# Altium schematic sheet Sheet2.SchDoc
size A3
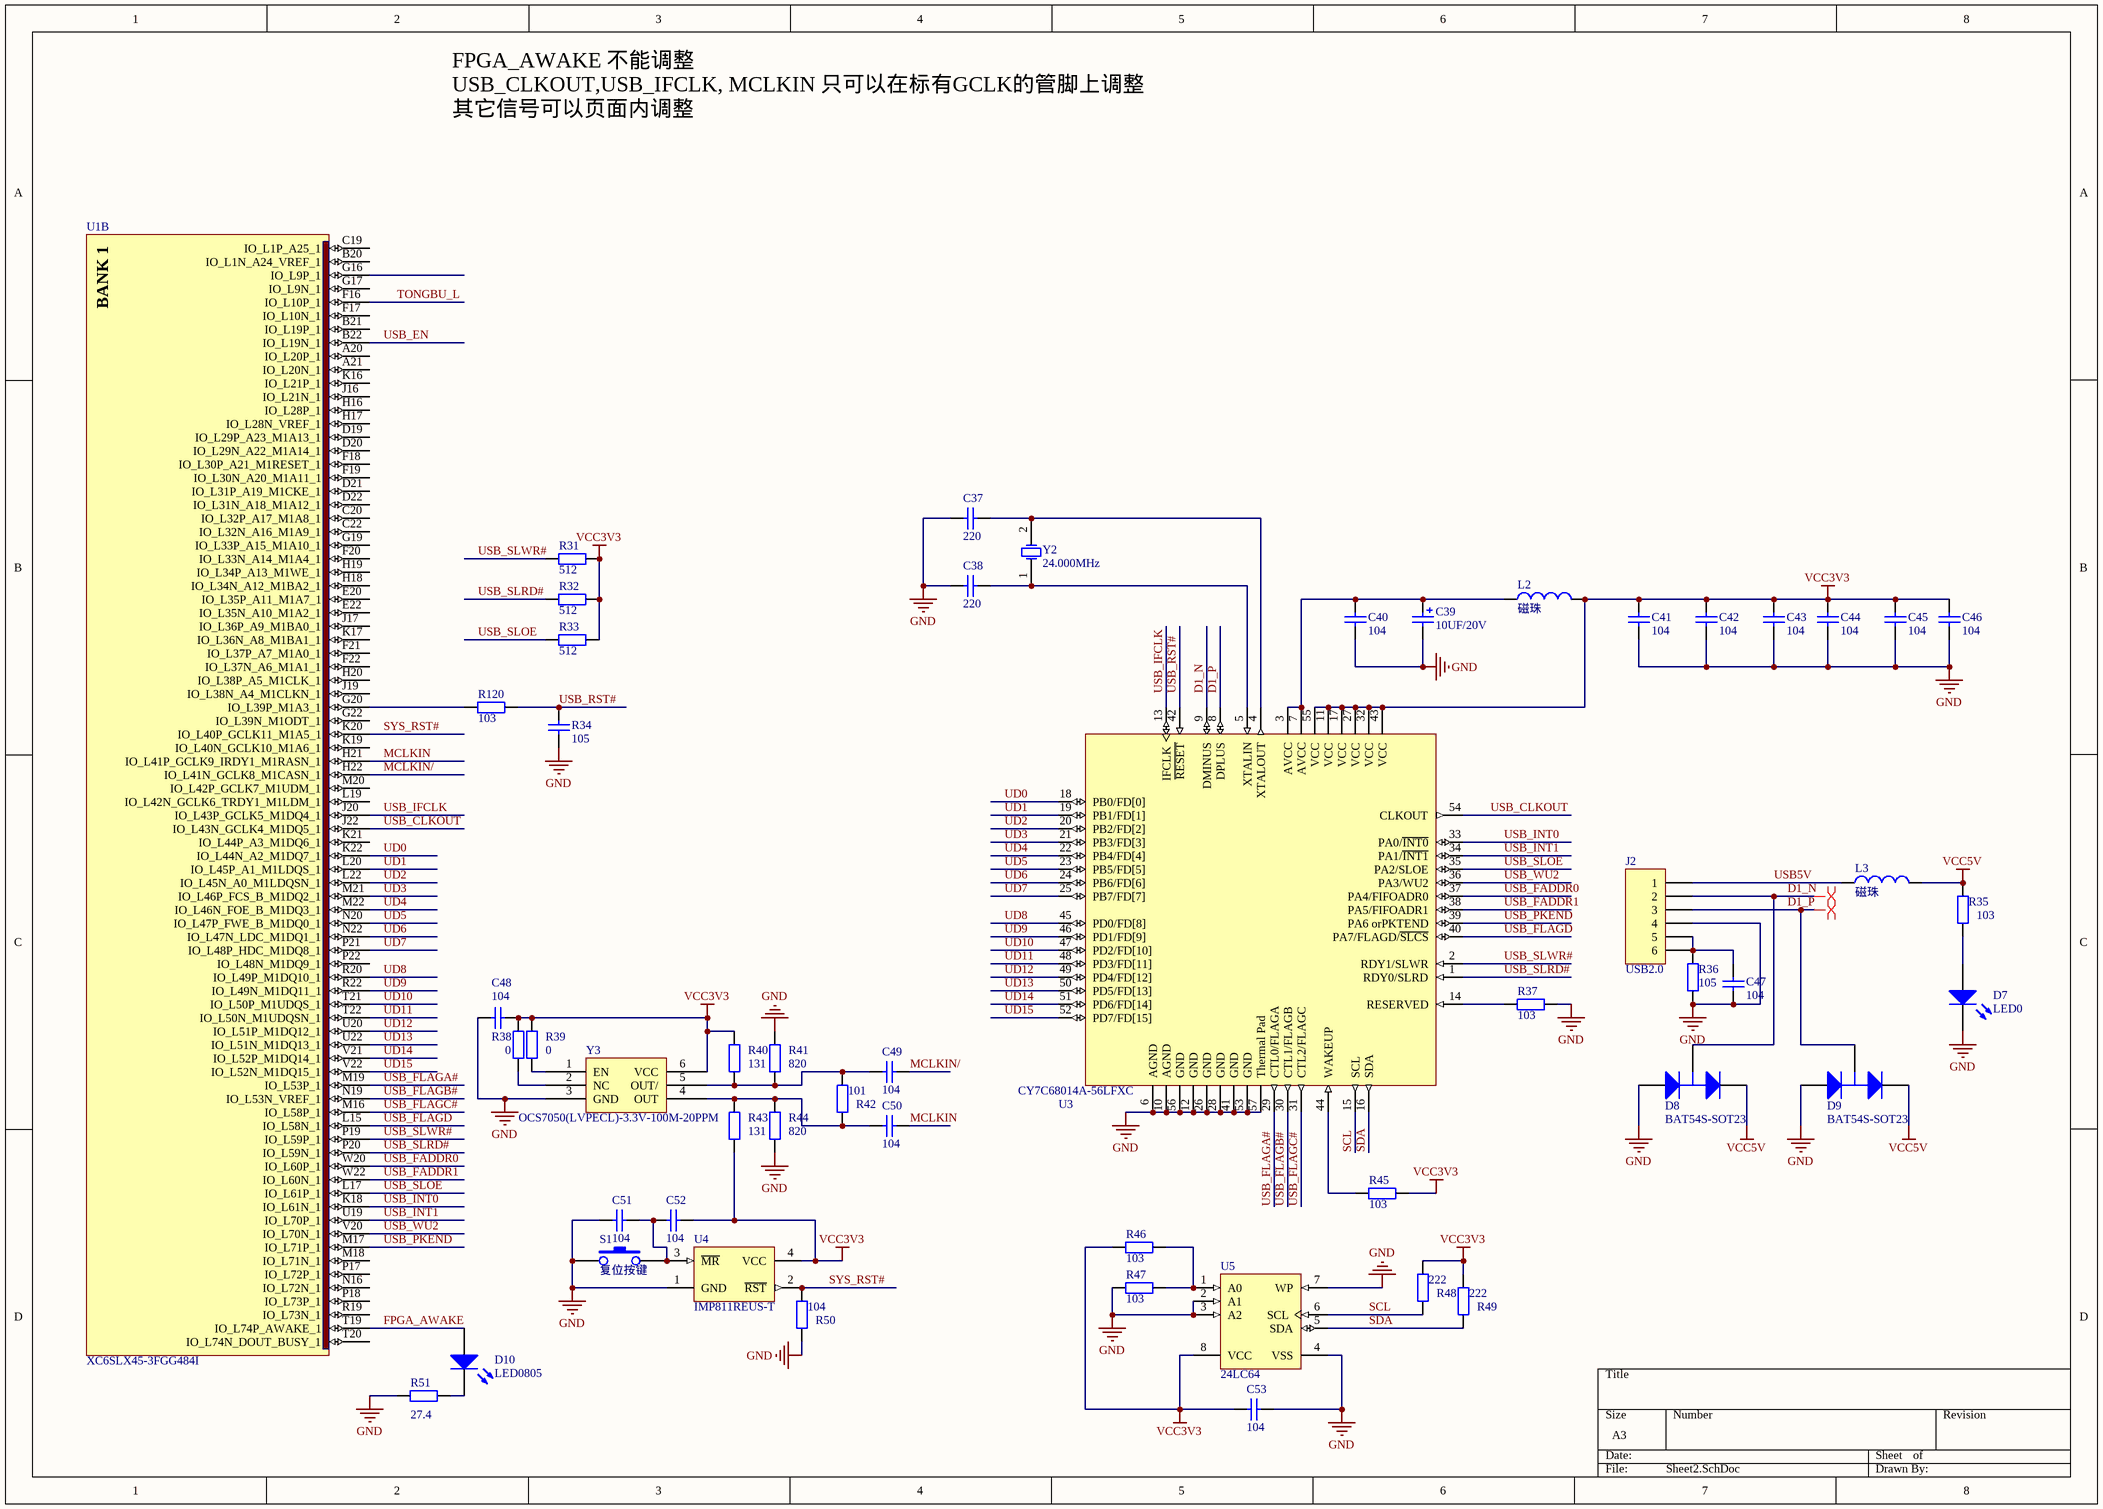
[diagram p0: Sheet2.SchDoc]

## Parts
C37  220  [0402]
C38  220  [0402]
C39  10UF/20V  [CAP-B]
C40  104  [0402]
C41  104  [0402]
C42  104  [0402]
C43  104  [0402]
C44  104  [0402]
C45  104  [0402]
C46  104  [0402]
C47  104  [0402]
C48  104  [0402]
C49  104  [0402]
C50  104  [0402]
C51  104  [0402]
C52  104  [0402]
C53  104  [0402]
D7  LED0  [0805LED]
D8  BAT54S-SOT23  [SOT23-3L]
D9  BAT54S-SOT23  [SOT23-3L]
D10  LED0805  [0805LED]
J2  USB2.0  [USB-B]
L2  磁珠  [1206A]
L3  磁珠  [1206A]
R31  512  [0603]
R32  512  [0603]
R33  512  [0603]
R34  105  [0603X]
R35  103  [0603]
R36  105  [0603]
R37  103  [0603]
R38  0  [0603]
R39  0  [0603]
R40  131  [0603]
R41  820  [0603]
R42  101  [0603]
R43  131  [0603]
R44  820  [0603]
R45  103  [0603]
R46  103  [0603]
R47  103  [0603]
R48  222  [0603]
R49  222  [0603]
R50  104  [0603]
R51  27.4  [0603]
R120  103  [0603]
S1  复位按键  [RESETKEY]
U1  XC6SLX45-3FGG484I  [FGG484]  (part B of 8)
U3  CY7C68014A-56LFXC  [LF56A_N]
U4  IMP811REUS-T  [SOT-143]
U5  24LC64  [SMD8XX]
Y2  24.000MHz  [CRYSTAL_2]
Y3  OCS7050(LVPECL)-3.3V-100M-20PPM  [CCPD-940X-033]

## Nets
GND: C37.1 C38.1 C39.2 C40.1 C41.1 C42.1 C43.1 C44.1 C45.1 C46.1 C47.2 C48.2 C51.2 C53.1 D7.2(K) D8.1(A) D9.1(A) J2.4 R34.1 R36.1 R37.2 R41.2 R44.1 R47.2 R50.1 R51.1 S1.1 U3.6(AGND) U3.10(AGND) U3.12(GND) U3.26(GND) U3.28(GND) U3.41(GND) U3.53(GND) U3.56(GND) U3.57(Thermal_Pad) U4.1(GND) U5.2(A1) U5.3(A2) U5.4(VSS) U5.7(WP) Y3.3(GND)
VCC3V3: C41.2 C42.2 C43.2 C44.2 C45.2 C46.2 C48.1 C52.1 C53.2 L2.2 R31.1 R32.1 R33.1 R38.1 R39.1 R40.2 R43.1 R45.1 R46.2 R48.1 R49.1 U3.11(VCC) U3.17(VCC) U3.27(VCC) U3.32(VCC) U3.43(VCC) U3.55(VCC) U4.4(VCC) U5.8(VCC) Y3.6(VCC)
VCC5V: D8.2(K) D9.2(K) L3.2 R35.2
D1_N: D8.3(C) J2.2 U3.9(DMINUS)
D1_P: D9.3(C) J2.3 U3.8(DPLUS)
FPGA_AWAKE: D10.1(A) U1.T19(IO_L74P_AWAKE_1)
MCLKIN: C50.2 U1.H21(IO_L41P_GCLK9_IRDY1_M1RASN_1)
MCLKIN/: C49.2 U1.H22(IO_L41N_GCLK8_M1CASN_1)
SCL: R48.2 U3.15(SCL) U5.6(SCL)
SDA: R49.2 U3.16(SDA) U5.5(SDA)
SYS_RST#: R50.2 U1.K20(IO_L40P_GCLK11_M1A5_1) U4.2(~{RST})
TONGBU_L: U1.F16(IO_L10P_1)
UD0: U1.K22(IO_L44N_A2_M1DQ7_1) U3.18(PB0/FD[0])
UD1: U1.L20(IO_L45P_A1_M1LDQS_1) U3.19(PB1/FD[1])
UD2: U1.L22(IO_L45N_A0_M1LDQSN_1) U3.20(PB2/FD[2])
UD3: U1.M21(IO_L46P_FCS_B_M1DQ2_1) U3.21(PB3/FD[3])
UD4: U1.M22(IO_L46N_FOE_B_M1DQ3_1) U3.22(PB4/FD[4])
UD5: U1.N20(IO_L47P_FWE_B_M1DQ0_1) U3.23(PB5/FD[5])
UD6: U1.N22(IO_L47N_LDC_M1DQ1_1) U3.24(PB6/FD[6])
UD7: U1.P21(IO_L48P_HDC_M1DQ8_1) U3.25(PB7/FD[7])
UD8: U1.R20(IO_L49P_M1DQ10_1) U3.45(PD0/FD[8])
UD9: U1.R22(IO_L49N_M1DQ11_1) U3.46(PD1/FD[9])
UD10: U1.T21(IO_L50P_M1UDQS_1) U3.47(PD2/FD[10])
UD11: U1.T22(IO_L50N_M1UDQSN_1) U3.48(PD3/FD[11])
UD12: U1.U20(IO_L51P_M1DQ12_1) U3.49(PD4/FD[12])
UD13: U1.U22(IO_L51N_M1DQ13_1) U3.50(PD5/FD[13])
UD14: U1.V21(IO_L52P_M1DQ14_1) U3.51(PD6/FD[14])
UD15: U1.V22(IO_L52N_M1DQ15_1) U3.52(PD7/FD[15])
USB5V: J2.1 L3.1
USB_CLKOUT: U1.J22(IO_L43N_GCLK4_M1DQ5_1) U3.54(CLKOUT)
USB_EN: U1.B22(IO_L19N_1)
USB_FADDR0: U1.W20(IO_L60P_1) U3.37(PA4/FIFOADR0)
USB_FADDR1: U1.W22(IO_L60N_1) U3.38(PA5/FIFOADR1)
USB_FLAGA#: U1.M19(IO_L53P_1) U3.29(CTL0/FLAGA)
USB_FLAGB#: U1.N19(IO_L53N_VREF_1) U3.30(CTL1/FLAGB)
USB_FLAGC#: U1.M16(IO_L58P_1) U3.31(CTL2/FLAGC)
USB_FLAGD: U1.L15(IO_L58N_1) U3.40(PA7/FLAGD/~{SLCS})
USB_IFCLK: U1.J20(IO_L43P_GCLK5_M1DQ4_1) U3.13(IFCLK)
USB_INT0: U1.K18(IO_L61N_1) U3.33(PA0/~{INT0})
USB_INT1: U1.U19(IO_L70P_1) U3.34(PA1/~{INT1})
USB_PKEND: U1.M17(IO_L71P_1) U3.39(PA6_orPKTEND)
USB_RST#: R34.2 R120.1 U3.42(~{RESET})
USB_SLOE: R33.2 U1.L17(IO_L61P_1) U3.35(PA2/SLOE)
USB_SLRD#: R32.2 U1.P20(IO_L59N_1) U3.1(RDY0/SLRD)
USB_SLWR#: R31.2 U1.P19(IO_L59P_1) U3.2(RDY1/SLWR)
USB_WU2: U1.V20(IO_L70N_1) U3.36(PA3/WU2)
NetC37_2: C37.2 U3.4(XTALOUT) Y2.2(OSC2)
NetC38_2: C38.2 U3.5(XTALIN) Y2.1(OSC1)
NetC39_1: C39.1 C40.2 L2.1 U3.3(AVCC) U3.7(AVCC)
NetC47_1: C47.1 J2.5 J2.6 R36.2
NetC49_1: C49.1 R40.1 R41.1 R42.2 Y3.5(OUT/)
NetC50_1: C50.1 R42.1 R43.2 R44.2 Y3.4(OUT)
NetC51_1: C51.1 C52.2 S1.2 U4.3(~{MR})
NetD7_1: D7.1(A) R35.1
NetD10_2: D10.2(K) R51.2
NetR37_1: R37.1 U3.14(RESERVED)
NetR38_2: R38.2 Y3.2(NC)
NetR39_2: R39.2 Y3.1(EN)
NetR45_2: R45.2 U3.44(WAKEUP)
NetR46_1: R46.1 R47.1 U5.1(A0)
NetR120_2: R120.2 U1.G20(IO_L39P_M1A3_1)

Not connected (* = marked no-connect by the designer): U1 A20(IO_L20P_1) A21(IO_L20N_1) B20(IO_L1N_A24_VREF_1) B21(IO_L19P_1) C19(IO_L1P_A25_1) C20(IO_L32P_A17_M1A8_1) C22(IO_L32N_A16_M1A9_1) D19(IO_L29P_A23_M1A13_1) D20(IO_L29N_A22_M1A14_1) D21(IO_L31P_A19_M1CKE_1) D22(IO_L31N_A18_M1A12_1) E20(IO_L35P_A11_M1A7_1) E22(IO_L35N_A10_M1A2_1) F17(IO_L10N_1) F18(IO_L30P_A21_M1RESET_1) F19(IO_L30N_A20_M1A11_1) F20(IO_L33N_A14_M1A4_1) F21(IO_L37P_A7_M1A0_1) F22(IO_L37N_A6_M1A1_1) G16(IO_L9P_1) G17(IO_L9N_1) G19(IO_L33P_A15_M1A10_1) G22(IO_L39N_M1ODT_1) H16(IO_L28P_1) H17(IO_L28N_VREF_1) H18(IO_L34N_A12_M1BA2_1) H19(IO_L34P_A13_M1WE_1) H20(IO_L38P_A5_M1CLK_1) J16(IO_L21N_1) J17(IO_L36P_A9_M1BA0_1) J19(IO_L38N_A4_M1CLKN_1) K16(IO_L21P_1) K17(IO_L36N_A8_M1BA1_1) K19(IO_L40N_GCLK10_M1A6_1) K21(IO_L44P_A3_M1DQ6_1) L19(IO_L42N_GCLK6_TRDY1_M1LDM_1) M18(IO_L71N_1) M20(IO_L42P_GCLK7_M1UDM_1) N16(IO_L72N_1) P17(IO_L72P_1) P18(IO_L73P_1) P22(IO_L48N_M1DQ9_1) R19(IO_L73N_1) T20(IO_L74N_DOUT_BUSY_1)

## Layout directives
differential pair: D1_N, D1_P

## Notes on the sheet
- FPGA_AWAKE 不能调整
  USB_CLKOUT,USB_IFCLK, MCLKIN 只可以在标有GCLK的管脚上调整
  其它信号可以页面内调整
- (in symbol XC6SLX45-3FGG484I, part B) BANK 1

## Library data of the parts
C37 C38 R34 = Cap: Capacitor; Value: 22pF; Published: 8-Jun-2000; LatestRevisionDate: 17-Jul-2002; LatestRevisionNote: Re-released for DXP Platform.; PackageReference: RAD-0.3; Publisher: Altium Limited
C39 = Cap Pol2: Polarized Capacitor (Axial); Value: 100pF; Published: 8-Jun-2000; LatestRevisionDate: 17-Jul-2002; LatestRevisionNote: Re-released for DXP Platform.; PackageReference: POLAR0.8; Publisher: Altium Limited
C40 = Cap: Capacitor; Value: 100pF; Published: 8-Jun-2000; LatestRevisionDate: 17-Jul-2002; LatestRevisionNote: Re-released for DXP Platform.; PackageReference: RAD-0.3; Publisher: Altium Limited
C41-C53 = Cap: Capacitor; Value: 0.1uF; Published: 8-Jun-2000; LatestRevisionDate: 17-Jul-2002; LatestRevisionNote: Re-released for DXP Platform.; PackageReference: RAD-0.3; Publisher: Altium Limited
D7 D10 = LED0: Typical INFRARED GaAs LED; Published: 8-Jun-2000; LatestRevisionDate: 08-Jul-2005; LatestRevisionNote: Mech Layer 1 removed.; PackageReference: LED-0; Publisher: Altium Limited
D8 D9 = BAV99: Silicon Switching Diode Array for High-Speed Switching; Published: 21-Mar-2003; DatasheetDocument: Oct-1999; PackageDocument: Sep-2001; PackageReference: SOT-23; Publisher: Altium Limited; ComponentLink1Description: Manufacturer Link; ComponentLink1URL: http://www.infineon.com/; ComponentLink2Description: Datasheet; ComponentLink2URL: http://www.infineon.com/upload/Document/cmc_upload/documents/080/631/bav99series_1.pdf
J2 = Header 6: Header, 6-Pin; LatestRevisionDate: 17-Jul-2002; LatestRevisionNote: Re-released for DXP Platform.; Publisher: Altium Limited
L2 L3 = Inductor: Code_IEC: 1005; Published: 8-Jun-2000; LatestRevisionDate: 29-May-2009; LatestRevisionNote: IPC-7351 Footprint Added.; PackageReference: 0402-A; Publisher: Altium Limited; PackageDescription: Chip Inductor; Code_JEITA: 0402
R31-R33 R38-R44 R50 R120 = Res2: Resistor; Value: 100K; Published: 8-Jun-2000; LatestRevisionDate: 17-Jul-2002; LatestRevisionNote: Re-released for DXP Platform.; PackageReference: AXIAL-0.4; Publisher: Altium Limited
R35-R37 R45-R47 = Res2: Resistor; Value: 10K; Published: 8-Jun-2000; LatestRevisionDate: 17-Jul-2002; LatestRevisionNote: Re-released for DXP Platform.; PackageReference: AXIAL-0.4; Publisher: Altium Limited
R48 R49 = Res2: Resistor; Value: 2.2K; Published: 8-Jun-2000; LatestRevisionDate: 17-Jul-2002; LatestRevisionNote: Re-released for DXP Platform.; PackageReference: AXIAL-0.4; Publisher: Altium Limited
R51 = Res2: Resistor; Published: 8-Jun-2000; LatestRevisionDate: 17-Jul-2002; LatestRevisionNote: Re-released for DXP Platform.; PackageReference: AXIAL-0.4; Publisher: Altium Limited; Value: 27.4
S1 = SW-PB
U1 = XC6SLX45-3FGG484I: Spartan-6 LX 1.2V FPGA, 316 User I/Os, 484-Ball Fine-Pitch BGA (1.0mm Pitch), Speed Grade 3, Industrial Grade, Pb-Free; FirstPublished: 17-Nov-2009; DatasheetVersion: ver1.3, Nov-2009; PackageVersion: ver1.1, Dec-2008; PackageReference: FGG484; Publisher: Altium Limited; PackageDescription: 484-Ball Fine Pitch Ball Grid Array 1.00 mm Pitch (FGG484) - Pb-Free; Code_JEDEC: MS-034-AAJ-1; Code_IPC: BGA100P22X22-484; ComponentLink1Description: Spartan-6 Datasheet; ComponentLink1URL: http://www.xilinx.com/support/documentation/data_sheets/ds160.pdf; ComponentLink2Description: Pinout Specification; ComponentLink2URL: http://www.xilinx.com/support/documentation/user_guides/ug385.pdf; ComponentLink3Description: FGG484 Package Drawing; ComponentLink3URL: http://www.xilinx.com/support/documentation/package_specs/fg484.pdf; ComponentLink4Description: Spartan-6 Documents; ComponentLink4URL: http://www.xilinx.com/support/documentation/spartan-6.htm; ComponentLink5Description: Xilinx.com Home; ComponentLink5URL: http://www.xilinx.com
U3 = CY7C68014A-56LFXC: EZ-USB FX2LP USB Microcontroller Ideal for Battery Powered Applications,16K RAM, 24 I/Os, 56-Pin QFN, Pb-Free, Commercial Grade; Published: 16-Dec-2005; LatestRevisionDate: 13-Apr-2006; LatestRevisionNote: IPC-7351 Footprint Added.; DatasheetVersion: rev.J, Sep-2005; PackageVersion: May-2003; PackageReference: LF56A; Publisher: Altium Limited; PackageDescription: 56-Pin Punch Version Quad Flat No-Lead 0.5 mm Pitch; Code_JEDEC: MO-220; ComponentLink1Description: Manufacturer Link; ComponentLink1URL: http://www.cypress.com/portal/server.pt; ComponentLink2Description: Datasheet; ComponentLink2URL: http://www.cypress.com/portal/server.pt/gateway/PTARGS_0_2_1524_209_259_43/http%3B/sjapp20.mis.cypress.com%3B7001/publishedcontent/publish/design_resources/datasheets/contents/cy7c68014a_5.pdf
U4 = MAX811-EUS-T: 4-Pin µP Voltage Monitors with Manual Reset Input; Published: 16-Jan-2001; LatestRevisionDate: 29-May-2009; LatestRevisionNote: IPC-7351 Footprint Added.; DatasheetVersion: Feb-1998; PackageVersion: Feb-1998; PackageReference: SOT143; Publisher: Altium Limited; PackageDescription: 4-Pin SOT-143 Package 1.9 mm Pitch, 2.3 mm Lead Span; ComponentLink1Description: Manufacturer Link; ComponentLink1URL: http://www.maxim-ic.com/; ComponentLink2Description: Datasheet; ComponentLink2URL: http://pdfserv.maxim-ic.com/en/ds/MAX811-MAX812.pdf
U5 = 24LC02B-I/SN: 2Kbit, 400kHz, 2.5V, I2C Serial EEPROM, 8-Pin SOIC 150mil, Industrial Temperature; FirstPublished: 29-Jan-2009; DatasheetVersion: revJ, Feb-2009; PackageVersion: revBB, Aug-2009; PackageReference: SOIC-SN8; Publisher: Altium Limited; PackageDescription: 8-Lead Plastic Small Outline (SN) - Narrow, 3.90mm Body [SOIC]; Supplier 1: Digi-Key; Supplier Part Number 1: 24LC02B-I/SN-ND; Supplier 2: Farnell; Supplier Part Number 2: 1196818; Supplier 3: Newark; Supplier Part Number 3: 12C1997; Code_JEDEC: MS-012; Code_IPC: SOIC127P600-8; ComponentLink1Description: Datasheet; ComponentLink1URL: http://ww1.microchip.com/downloads/en/DeviceDoc/21709J.pdf; ComponentLink2Description: Packaging Specification; ComponentLink2URL: http://www.microchip.com/stellent/groups/techpub_sg/documents/packagingspec/en012702.pdf; ComponentLink3Description: Microchip.com Home; ComponentLink3URL: http://www.microchip.com/
Y2 = XTAL: Crystal Oscillator; Published: 8-Jun-2000; LatestRevisionDate: 17-Jul-2002; LatestRevisionNote: Re-released for DXP Platform.; PackageReference: R38; Publisher: Altium Limited
Y3 = Component_1